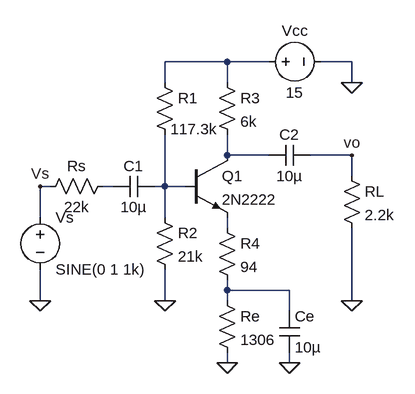
[diagram p0: schematic pre4.asc]
pre4.asc, the LTspice schematic file:
Version 4.1
SHEET 1 1896 680
WIRE 1504 -256 1408 -256
WIRE 1568 -256 1504 -256
WIRE 1696 -256 1648 -256
WIRE 1408 -224 1408 -256
WIRE 1504 -224 1504 -256
WIRE 1696 -224 1696 -256
WIRE 1504 -112 1504 -144
WIRE 1568 -112 1504 -112
WIRE 1696 -112 1632 -112
WIRE 1696 -80 1696 -112
WIRE 1232 -64 1216 -64
WIRE 1328 -64 1312 -64
WIRE 1408 -64 1408 -144
WIRE 1408 -64 1392 -64
WIRE 1440 -64 1408 -64
WIRE 1216 -16 1216 -64
WIRE 1408 -16 1408 -64
WIRE 1504 0 1504 -16
WIRE 1504 96 1504 80
WIRE 1600 96 1504 96
WIRE 1216 112 1216 64
WIRE 1408 112 1408 64
WIRE 1504 112 1504 96
WIRE 1696 112 1696 0
WIRE 1600 128 1600 96
WIRE 1504 208 1504 192
WIRE 1600 208 1600 192
FLAG 1216 112 0
FLAG 1408 112 0
FLAG 1600 208 0
FLAG 1504 208 0
FLAG 1696 112 0
FLAG 1696 -224 0
FLAG 1696 -112 vo
FLAG 1216 -64 Vs
SYMBOL voltage 1216 -32 R0
WINDOW 123 0 0 Left 0
WINDOW 39 0 0 Left 0
SYMATTR InstName Vs
SYMATTR Value SINE(0 1 1k)
SYMBOL res 1328 -80 R90
WINDOW 0 0 56 VBottom 2
WINDOW 3 32 56 VTop 2
SYMATTR InstName Rs
SYMATTR Value 22k
SYMBOL cap 1392 -80 R90
WINDOW 0 0 32 VBottom 2
WINDOW 3 32 32 VTop 2
SYMATTR InstName C1
SYMATTR Value 10µ
SYMBOL res 1392 -32 R0
SYMATTR InstName R2
SYMATTR Value 21k
SYMBOL res 1392 -240 R0
WINDOW 3 25 88 Left 2
SYMATTR InstName R1
SYMATTR Value 117.3k
SYMBOL npn 1440 -112 R0
SYMATTR InstName Q1
SYMATTR Value 2N2222
SYMBOL res 1488 -240 R0
SYMATTR InstName R3
SYMATTR Value 6k
SYMBOL cap 1584 128 R0
SYMATTR InstName Ce
SYMATTR Value 10µ
SYMBOL res 1488 96 R0
SYMATTR InstName Re
SYMATTR Value 1306
SYMBOL cap 1632 -128 R90
WINDOW 0 0 32 VBottom 2
WINDOW 3 32 32 VTop 2
SYMATTR InstName C2
SYMATTR Value 10µ
SYMBOL voltage 1552 -256 R270
WINDOW 0 32 56 VTop 2
WINDOW 3 -32 56 VBottom 2
SYMATTR InstName Vcc
SYMATTR Value 15
SYMBOL res 1680 -96 R0
SYMATTR InstName RL
SYMATTR Value 2.2k
SYMBOL res 1488 -16 R0
SYMATTR InstName R4
SYMATTR Value 94

The netlist it stands for:
* pre4.asc
Vs Vs 0 SINE(0 1 1k)
Rs N003 Vs 22k
C1 N004 N003 10µ
R2 N004 0 21k
R1 N001 N004 117.3k
Q1 N002 N004 N005 0 2N2222
R3 N001 N002 6k
Ce N006 0 10µ
Re N006 0 1306
C2 vo N002 10µ
Vcc N001 0 15
RL vo 0 2.2k
R4 N005 N006 94
.model NPN NPN
.model PNP PNP
.lib standard.bjt
.backanno
.end